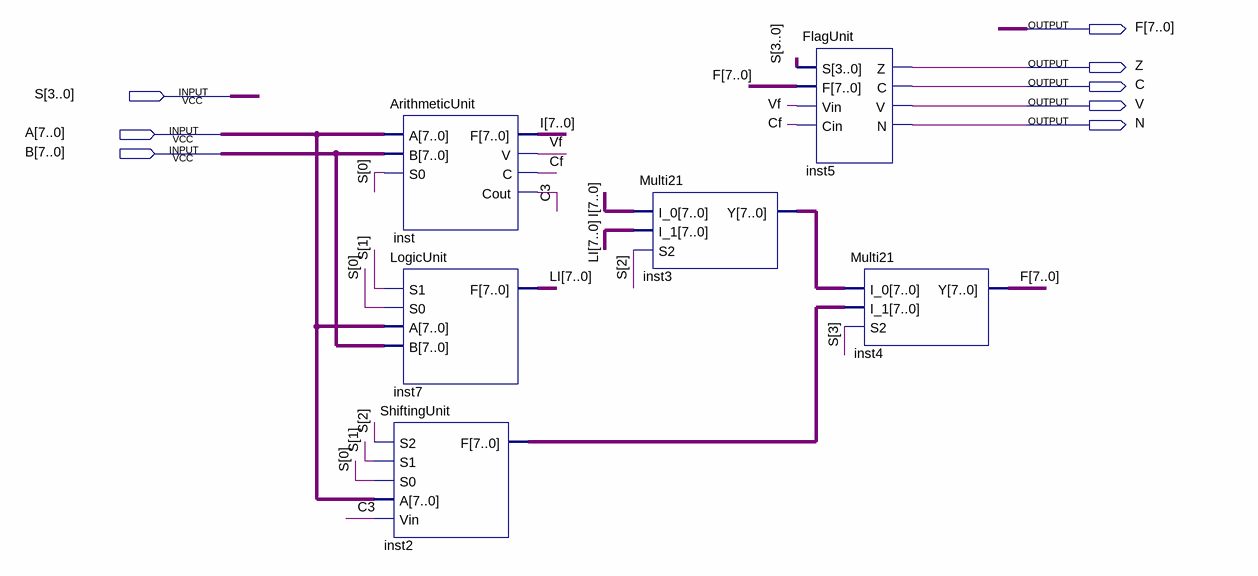
[diagram p0: schematic sheet]
// Quartus schematic ALU.bdf as structural Verilog: 6 symbols, 8 pins
module ALU (
  input  [3:0] S,
  input  [7:0] A,
  input  [7:0] B,
  output [7:0] F,
  output Z,
  output C,
  output V,
  output N
);

  wire C3, Cf, Vf;
  wire [7:0] I, inst2_f, inst3_y, LI;

  ArithmeticUnit inst (.A(A), .B(B), .S0(S[0]), .F(I), .V(Vf), .C(Cf), .Cout(C3));
  LogicUnit inst7 (.S1(S[1]), .S0(S[0]), .A(A), .B(B), .F(LI));
  ShiftingUnit inst2 (.S2(S[2]), .S1(S[1]), .S0(S[0]), .A(A), .Vin(C3), .F(inst2_f));
  Multi21 inst3 (.I_0(I), .I_1(LI), .S2(S[2]), .Y(inst3_y));
  FlagUnit inst5 (.S(S), .F(F), .Vin(Vf), .Cin(Cf), .Z(Z), .C(C), .V(V), .N(N));
  Multi21 inst4 (.I_0(inst3_y), .I_1(inst2_f), .S2(S[3]), .Y(F));
endmodule
